# EAGLE design circuito (EAGLE 7.6.0)
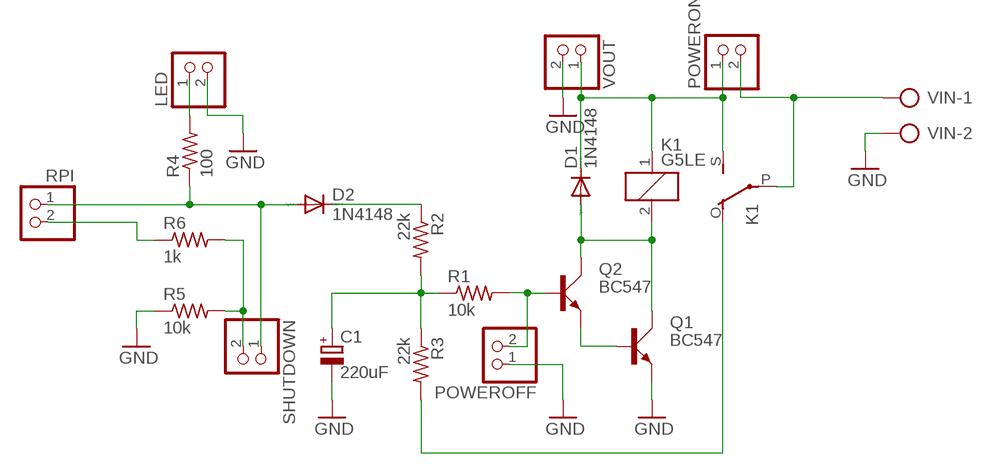
[diagram p0: schematic, sheet 1]

## Parts
C1  220uF  CPOL-EUE2,5-6E  [E2,5-6E]
D1  1N4148  1N4148DO35-7  [DO35-7]
D2  1N4148  1N4148DO35-7  [DO35-7]
K1  G5LE  [G5LE]
LED  PINHD-1X2  [1X02]
POWEROFF  PINHD-1X2  [1X02]
POWERON  PINHD-1X2  [1X02]
Q1  BC547  [SOT54A]
Q2  BC547  [SOT54A]
R1  10k  R-US_0207/7  [0207/7]
R2  22k  R-US_0207/7  [0207/7]
R3  22k  R-US_0207/7  [0207/7]
R4  100  R-US_0207/7  [0207/7]
R5  10k  R-US_0207/7  [0207/7]
R6  1k  R-US_0207/7  [0207/7]
RPI  PINHD-1X2  [1X02]
SHUTDOWN  PINHD-1X2  [1X02]
VIN  AK500/2-H  [AK500/2-H]
VOUT  PINHD-1X2  [1X02]

## Nets
GND: C1.- LED.2 POWEROFF.1 Q1.E R5.1 VIN.2 VOUT.2
N$1: C1.+ R1.1 R2.2 R3.1
N$2: D1.C K1.1 K1.S(2:S) POWERON.1 VOUT.1
N$3: Q1.B Q2.E
N$4: D1.A K1.2 Q1.C Q2.C
N$5: K1.P(2:P) POWERON.2 VIN.1
N$6: POWEROFF.2 Q2.B R1.2
N$7: D2.C R2.1
N$8: D2.A R4.1 RPI.1 SHUTDOWN.1
N$9: K1.O(2:O) R3.2
N$10: LED.1 R4.2
N$11: R6.1 RPI.2
N$12: R5.2 R6.2 SHUTDOWN.2

## Library data of the parts
C1 = rcl:CPOL-EU: POLARIZED CAPACITOR, European symbol
D1 D2 = diode:1N4148: DIODE high speed (Philips)
K1 = relay:G5LE: RELAY 1 x switch, 10 A/120 V AC, 8 A/30 V DC, Omron; OC_FARNELL: unknown; OC_NEWARK: unknown
LED POWEROFF POWERON RPI SHUTDOWN VOUT = pinhead:PINHD-1X2: PIN HEADER
Q1 Q2 = transistor-small-signal:BC547: NPN TRANSISTOR
R1-R6 = rcl:R-US_: RESISTOR, American symbol
VIN = con-ptr500:AK500/2-H: CONNECTOR Aug. 2004 / PTR Meßtechnik: Die Bezeichnung der Serie AK505 wurde geändert. Es handelt sich hierbei um AK500 in horizontaler Ausführung.; OC_FARNELL: unknown; OC_NEWARK: unknown

## Board
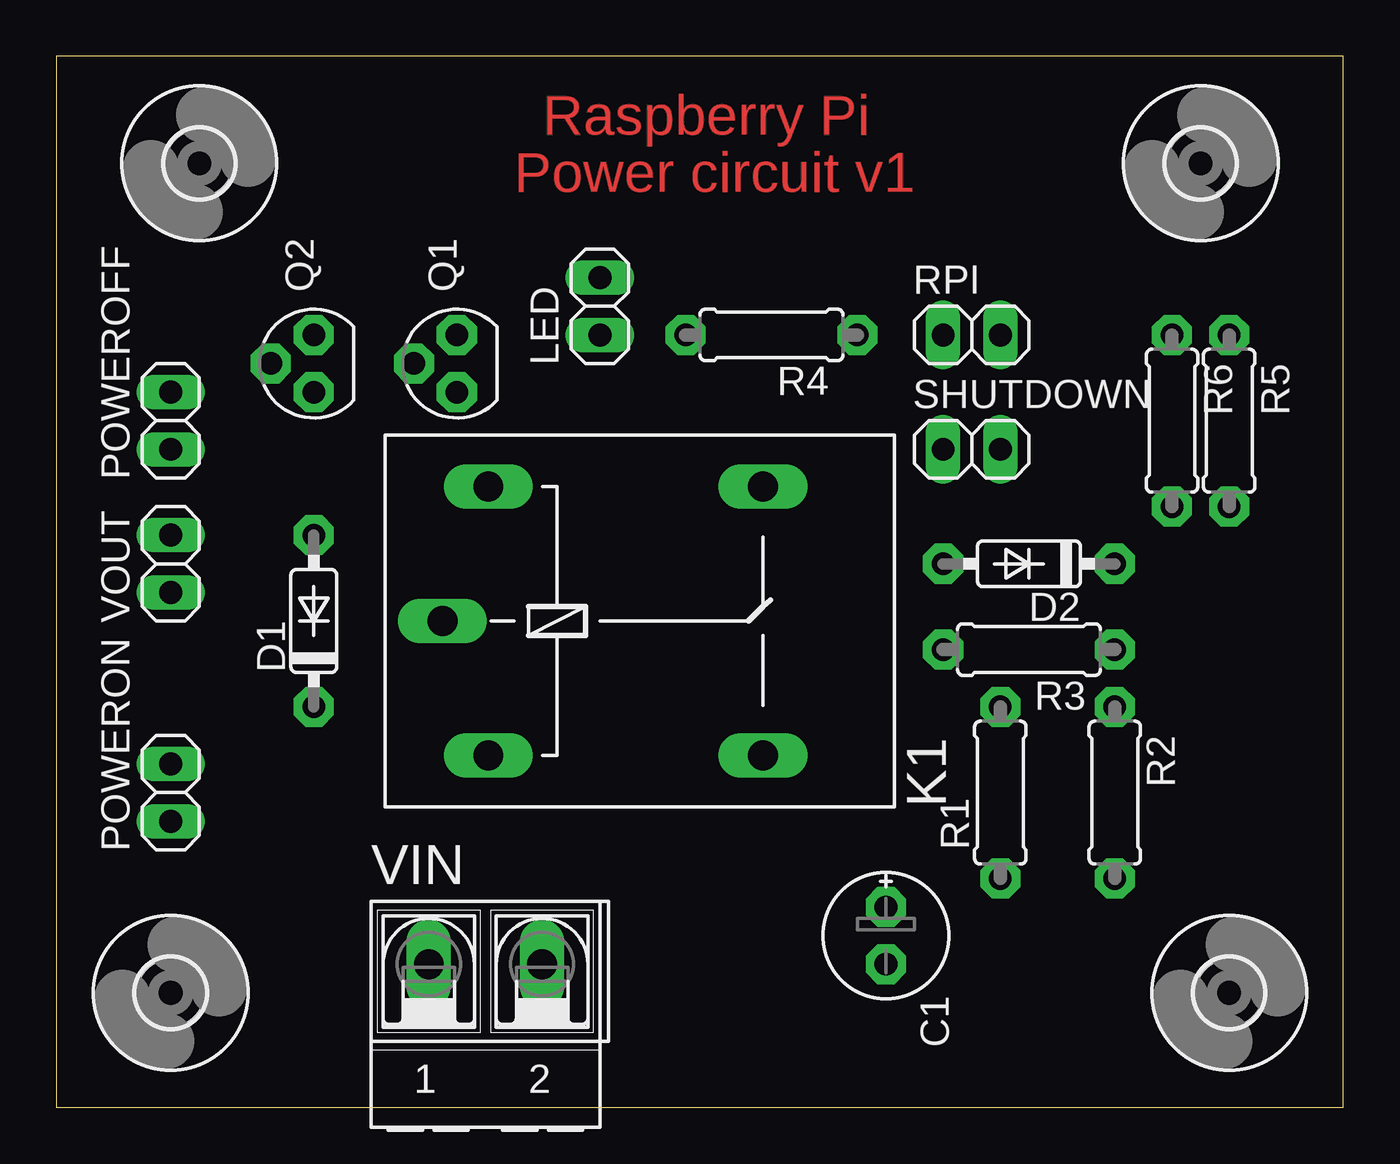
[diagram p1: board, top side]
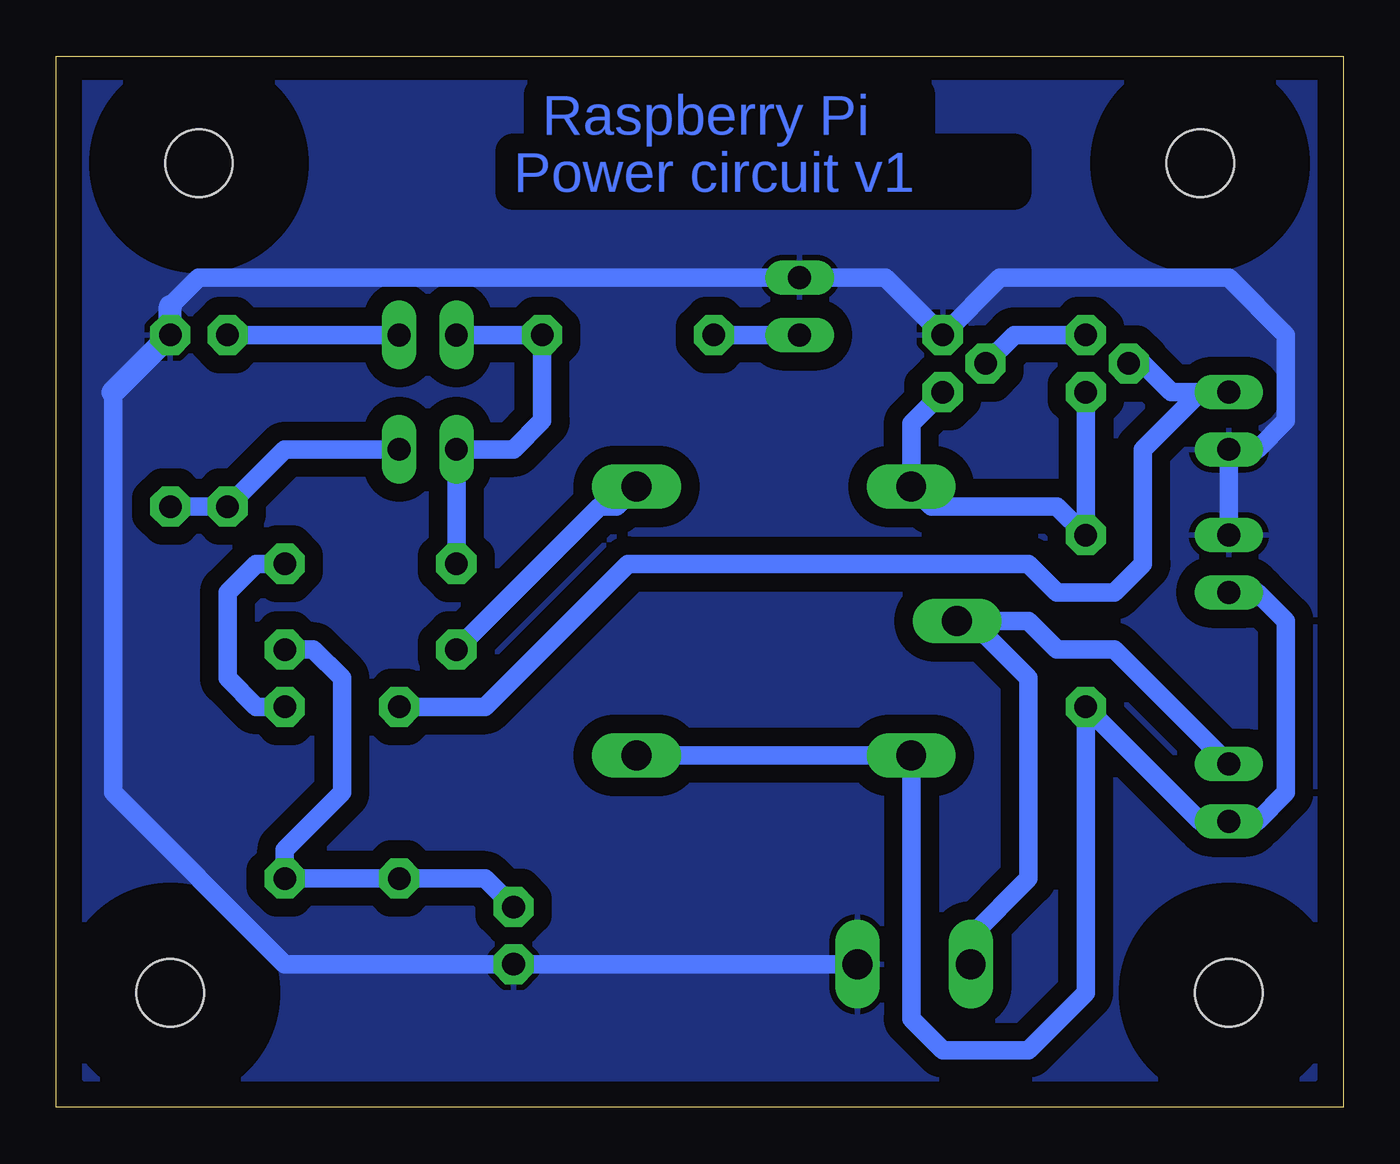
[diagram p2: board, bottom side, seen from below]

Size 57.13 x 46.66 mm. Coordinates in mm from the lower left corner, seen from the top.
Outline: 0,0 57.13,0 57.13,46.66 0,46.66 0,0
Copper layers (1*16): Top 0.035mm / dielectric 1.5mm / Bottom 0.035mm
Design rules "default": minimum track width 10mil, minimum drill 24mil, track to track 8mil, track to pad 8mil, pad to pad 8mil, via to via 8mil, smd to smd 8mil, copper to edge 40mil, drill to drill 8mil, minimum pad ring 10mil, minimum via ring 8mil, stop-mask expansion 4mil, vias tented up to drill 0mil, thermal gap 10mil

### Footprints (pad centres in the part's own frame; a part is rotated, then mirrored left to right if it is on the bottom)
E2,5-6E = drill 1 pad 1.778 octagon: + -1.27,0; - 1.27,0
DO35-7 = drill 1 pad 1.778 octagon: A 3.81,0; C -3.81,0
G5LE = drill 1.321 long: 1 -7.493,-5.969; 2 -7.493,5.969; O 4.699,5.969; P -9.525,0; S 4.699,-5.969
1X02 = drill 1.016 long: 1 -1.27,0; 2 1.27,0
SOT54A = drill 1 pad 1.778 octagon: B 0,1.905; C -1.27,0; E 1.27,0
0207/7 = drill 1 pad 1.778 octagon: 1 -3.81,0; 2 3.81,0
3,0 = hole 3: 0,0
AK500/2-H = drill 1.321 long: 1 -2.515,0; 2 2.515,0

### Placement (x,y rotation side)
C1  36.83,7.62 270 top
D1  11.43,21.59 90 top
D2  43.18,24.13 180 top
K1  26.67,21.59 0 top
LED  24.13,35.56 90 top
POWEROFF  5.08,30.48 90 top
POWERON  5.08,13.97 90 top
Q1  17.78,33.02 90 top
Q2  11.43,33.02 90 top
R1  41.91,13.97 90 top
R2  46.99,13.97 270 top
R3  43.18,20.32 180 top
R4  31.75,34.29 180 top
R5  52.07,30.48 270 top
R6  49.53,30.48 270 top
RPI  40.64,34.29 0 top
SHUTDOWN  40.64,29.21 0 top
U$1  [3,0]  5.08,5.08 0 top
U$2  [3,0]  6.35,41.91 0 top
U$3  [3,0]  50.8,41.91 0 top
U$4  [3,0]  52.07,5.08 0 top
VIN  19.05,6.35 0 top
VOUT  5.08,24.13 90 top

### Tracks (layer width: path | path; a pad name or v marks a point on that pad's centre or on a via)
GND
  Bottom 0.813: 52.07,35.56 50.8,36.83 LED.2 20.32,36.83 Q1.E 15.24,36.83 5.08,36.83 2.54,34.29 2.54,30.48 3.81,29.21 POWEROFF.1 VOUT.2 | VIN.2 C1.- 46.99,6.35 54.61,13.97 54.61,31.75
  Bottom 1.016: 52.07,35.56 R5.1 54.61,31.75
  pour Bottom (isolate 0.813): 1.27,1.27 55.88,1.27 55.88,45.72 1.27,45.72
N$1
  Bottom 0.813: C1.+ 38.1,10.16 R1.1 R2.2 46.99,11.43 44.45,13.97 44.45,19.05 45.72,20.32 R3.1
N$2
  Bottom 0.813: K1.S K1.1 19.18,3.94 17.78,2.54 13.97,2.54 11.43,5.08 D1.C 6.35,12.7 POWERON.1 3.81,12.7 2.54,13.97 2.54,21.59 3.81,22.86 VOUT.1
N$3
  Bottom 0.813: Q2.E 14.61,34.29 Q1.B
N$4
  Bottom 0.813: Q1.C 19.18,30.35 K1.2 18.29,26.67 12.7,26.67 D1.A Q2.C
N$5
  Bottom 0.813: VIN.1 16.54,7.59 13.97,10.16 13.97,19.05 16.51,21.59 K1.P 13.97,21.59 12.7,20.32 10.16,20.32 POWERON.2
N$6
  Bottom 0.813: R1.2 38.1,17.78 31.75,24.13 13.97,24.13 12.7,22.86 10.16,22.86 8.89,24.13 8.89,29.21 6.35,31.75 | 6.35,31.75 POWEROFF.2 | 6.35,31.75 7.62,31.75 8.89,33.02 Q2.B
N$7
  Bottom 0.813: R2.1 48.26,17.78 49.53,19.05 49.53,22.86 48.26,24.13 D2.C
N$8
  Bottom 0.813: D2.A SHUTDOWN.1 36.83,29.21 35.56,30.48 R4.1 RPI.1
N$9
  Bottom 0.813: R3.2 33.02,26.67 32.26,26.67 K1.O
N$10
  Bottom 0.813: LED.1 R4.2
N$11
  Bottom 0.813: RPI.2 R6.1
N$12
  Bottom 0.813: R5.2 R6.2 46.99,29.21 SHUTDOWN.2

### Text on the board
Top: Raspberry Pi | Power circuit v1
Bottom: Raspberry Pi | Power circuit v1